# EAGLE design CAS (EAGLE 8.3.1)
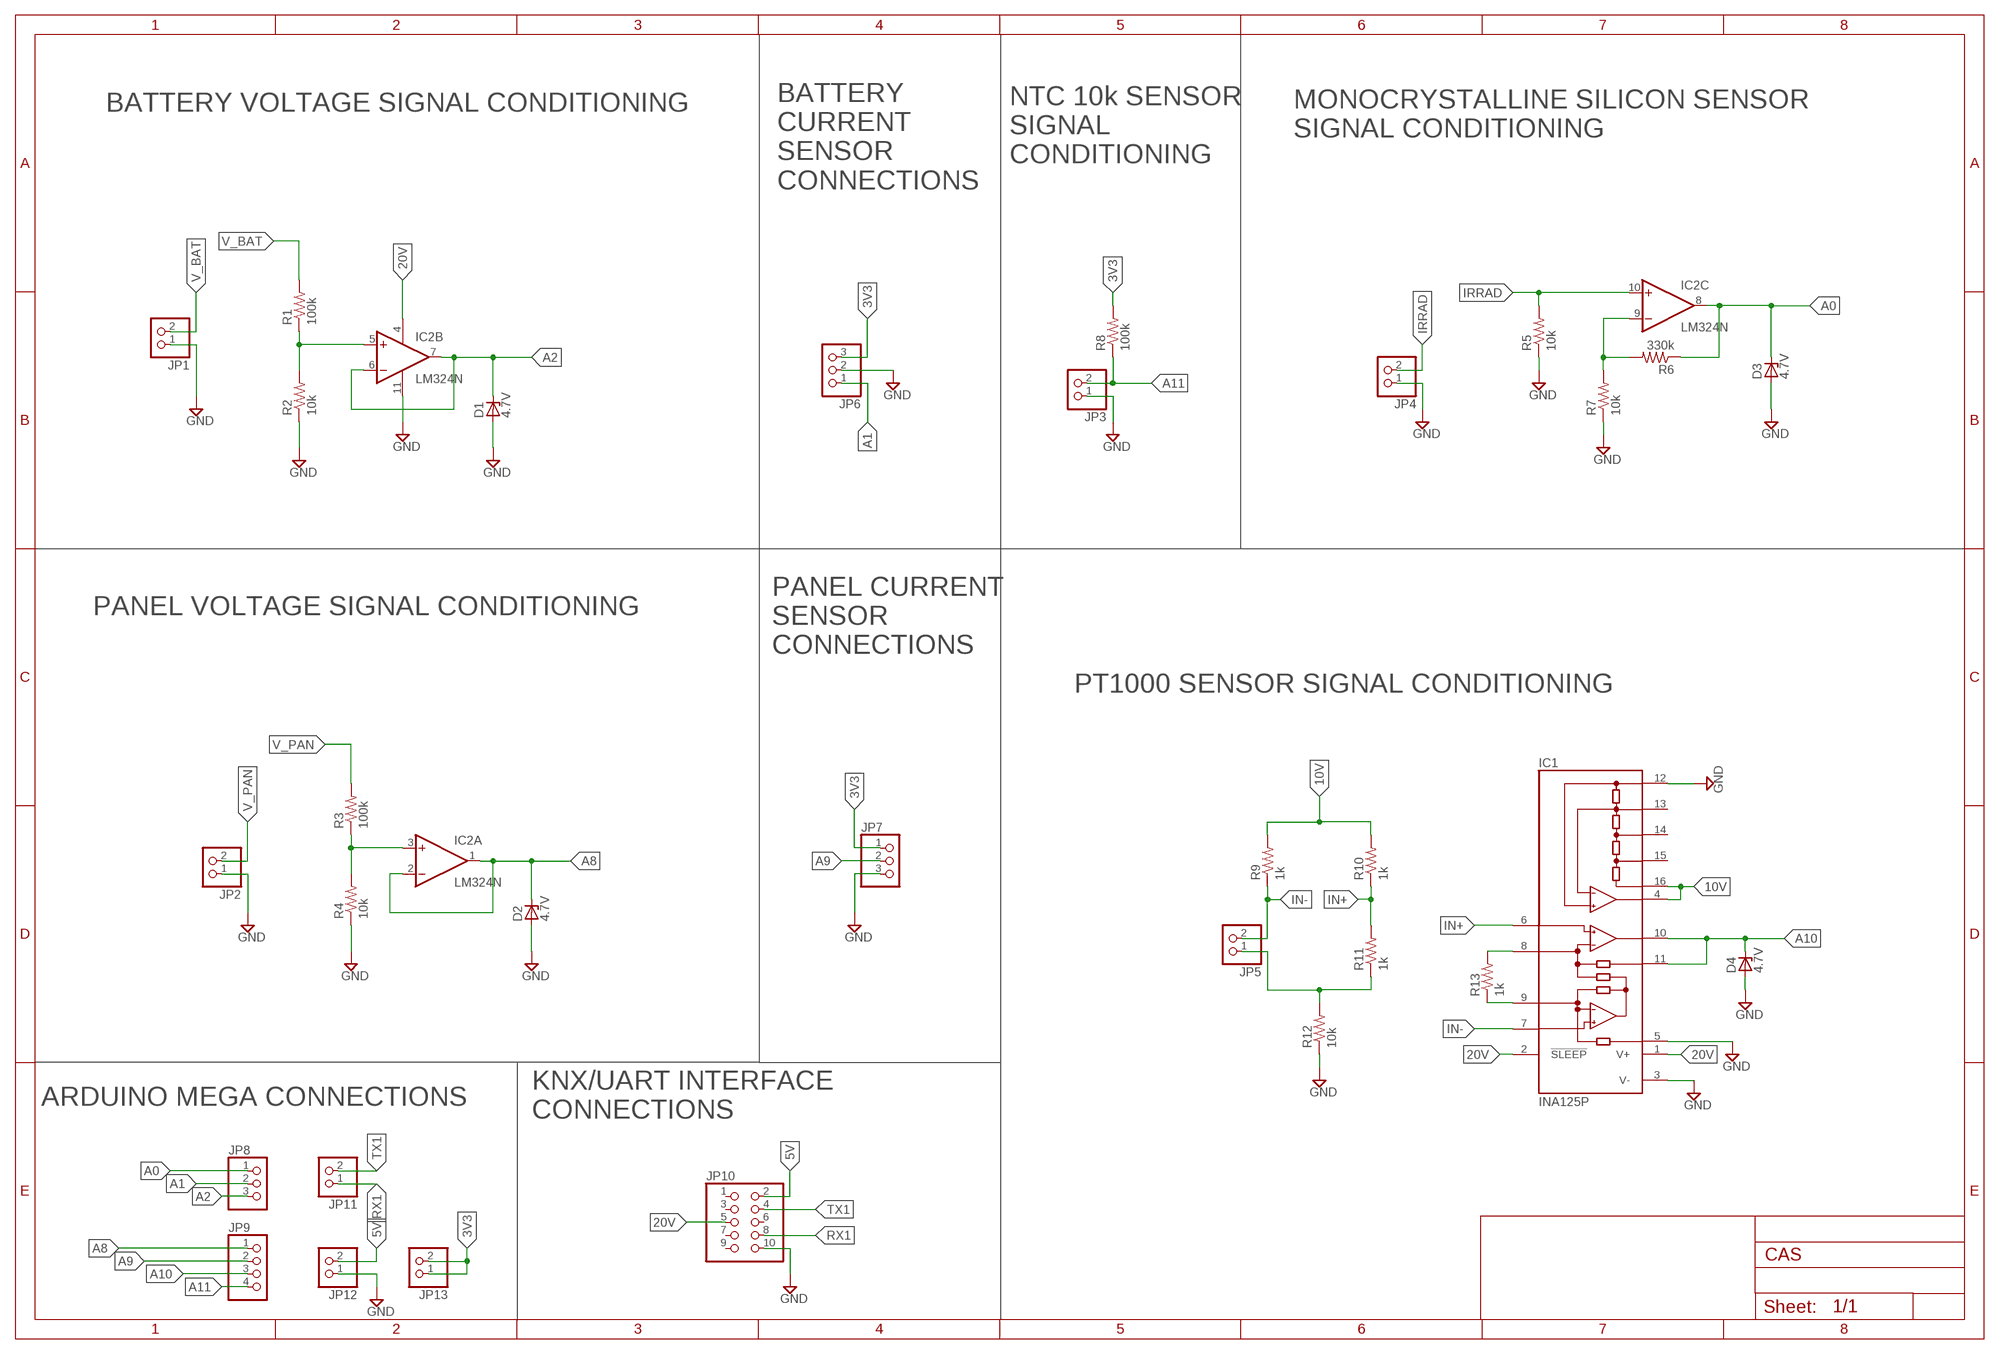
[diagram p0: schematic, sheet 1]

## Parts
D1  4.7V  ZENER-DIODEDO41Z10  [DO41Z10]
D2  4.7V  ZENER-DIODEDO41Z10  [DO41Z10]
D3  4.7V  ZENER-DIODEDO41Z10  [DO41Z10]
D4  4.7V  ZENER-DIODEDO41Z10  [DO41Z10]
IC1  INA125P  [DIL16]
IC2  LM324N  [DIL14]
JP1  PINHD-1X2  [1X02]
JP2  PINHD-1X2  [1X02]
JP3  PINHD-1X2  [1X02]
JP4  PINHD-1X2  [1X02]
JP5  PINHD-1X2  [1X02]
JP6  PINHD-1X3  [1X03]
JP7  PINHD-1X3  [1X03]
JP8  PINHD-1X3  [1X03]
JP9  PINHD-1X4  [1X04]
JP10  PINHD-2X5  [2X05]
JP11  PINHD-1X2  [1X02]
JP12  PINHD-1X2  [1X02]
JP13  PINHD-1X2  [1X02]
R1  100k  R-US_0207/10  [0207/10]
R2  10k  R-US_0207/10  [0207/10]
R3  100k  R-US_0207/10  [0207/10]
R4  10k  R-US_0207/10  [0207/10]
R5  10k  R-US_0207/10  [0207/10]
R6  330k  R-US_0207/10  [0207/10]
R7  10k  R-US_0207/10  [0207/10]
R8  100k  R-US_0207/10  [0207/10]
R9  1k  R-US_0207/10  [0207/10]
R10  1k  R-US_0207/10  [0207/10]
R11  1k  R-US_0207/10  [0207/10]
R12  10k  R-US_0207/10  [0207/10]
R13  1k  R-US_0207/10  [0207/10]

## Nets
3V3: JP6.3 JP7.1 JP13.1 JP13.2 R8.2
5V: JP10.2 JP12.2
10V: IC1.4(REFOUT) IC1.16(REF10) R9.2 R10.2
20V: IC1.1(V+) IC1.2(!SLEEP) IC2.4(P:V+) JP10.5
A0: D3.C IC2.8(C:OUT) JP8.1 R6.1
A1: JP6.1 JP8.2
A2: D1.C IC2.6(B:-IN) IC2.7(B:OUT) JP8.3
A8: D2.C IC2.1(A:OUT) IC2.2(A:-IN) JP9.1
A9: JP7.2 JP9.2
A10: D4.C IC1.10(OUT) IC1.11(SENSE) JP9.3
A11: JP3.2 JP9.4 R8.1
GND: D1.A D2.A D3.A D4.A IC1.3(V-) IC1.5(REF) IC1.12(REFCOM) IC2.11(P:V-) JP1.1 JP2.1 JP3.1 JP4.1 JP6.2 JP7.3 JP10.10 JP12.1 R2.1 R4.1 R5.1 R7.1 R12.1
IN+: IC1.6(+IN) R10.1 R11.2
IN-: IC1.7(-IN) JP5.2 R9.1
IRRAD: IC2.10(C:+IN) JP4.2 R5.2
N$1: IC2.3(A:+IN) R3.1 R4.2
N$2: IC2.5(B:+IN) R1.1 R2.2
N$4: IC2.9(C:-IN) R6.2 R7.2
N$5: IC1.8(RG) R13.2
N$6: IC1.9(RG) R13.1
N$10: JP5.1 R11.1 R12.2
RX1: JP10.8 JP11.1
TX1: JP10.4 JP11.2
V_BAT: JP1.2 R1.2
V_PAN: JP2.2 R3.2
Unconnected: IC1.13(REFBG) IC1.14(REF2.5) IC1.15(REF5) IC2.12(D:+IN) IC2.13(D:-IN) IC2.14(D:OUT) JP10.1 JP10.3 JP10.6 JP10.7 JP10.9

## Notes on the sheet
- BATTERY VOLTAGE SIGNAL CONDITIONING
- MONOCRYSTALLINE SILICON SENSOR 
  SIGNAL CONDITIONING
- NTC 10k SENSOR
  SIGNAL 
  CONDITIONING
- BATTERY
  CURRENT
  SENSOR 
  CONNECTIONS
- PANEL VOLTAGE SIGNAL CONDITIONING
- PANEL CURRENT
  SENSOR 
  CONNECTIONS
- PT1000 SENSOR SIGNAL CONDITIONING
- ARDUINO MEGA CONNECTIONS
- KNX/UART INTERFACE 
  CONNECTIONS

## Library data of the parts
D1-D4 = diode:ZENER-DIODE: Z-Diode
IC1 = burr-brown:INA125: Instrumentation Amplifier with Precision Voltage Reference; MF: TEXAS INSTRUMENT CONNECTORS; MPN: INA125P; OC_FARNELL: 1459461; OC_NEWARK: 35C1726
IC2 = linear:LM324: OP AMP
JP1-JP5 JP11-JP13 = pinhead:PINHD-1X2: PIN HEADER
JP6-JP8 = pinhead:PINHD-1X3: PIN HEADER
JP9 = pinhead:PINHD-1X4: PIN HEADER
JP10 = pinhead:PINHD-2X5: PIN HEADER
R1-R13 = resistor:R-US_: RESISTOR, American symbol

## Board
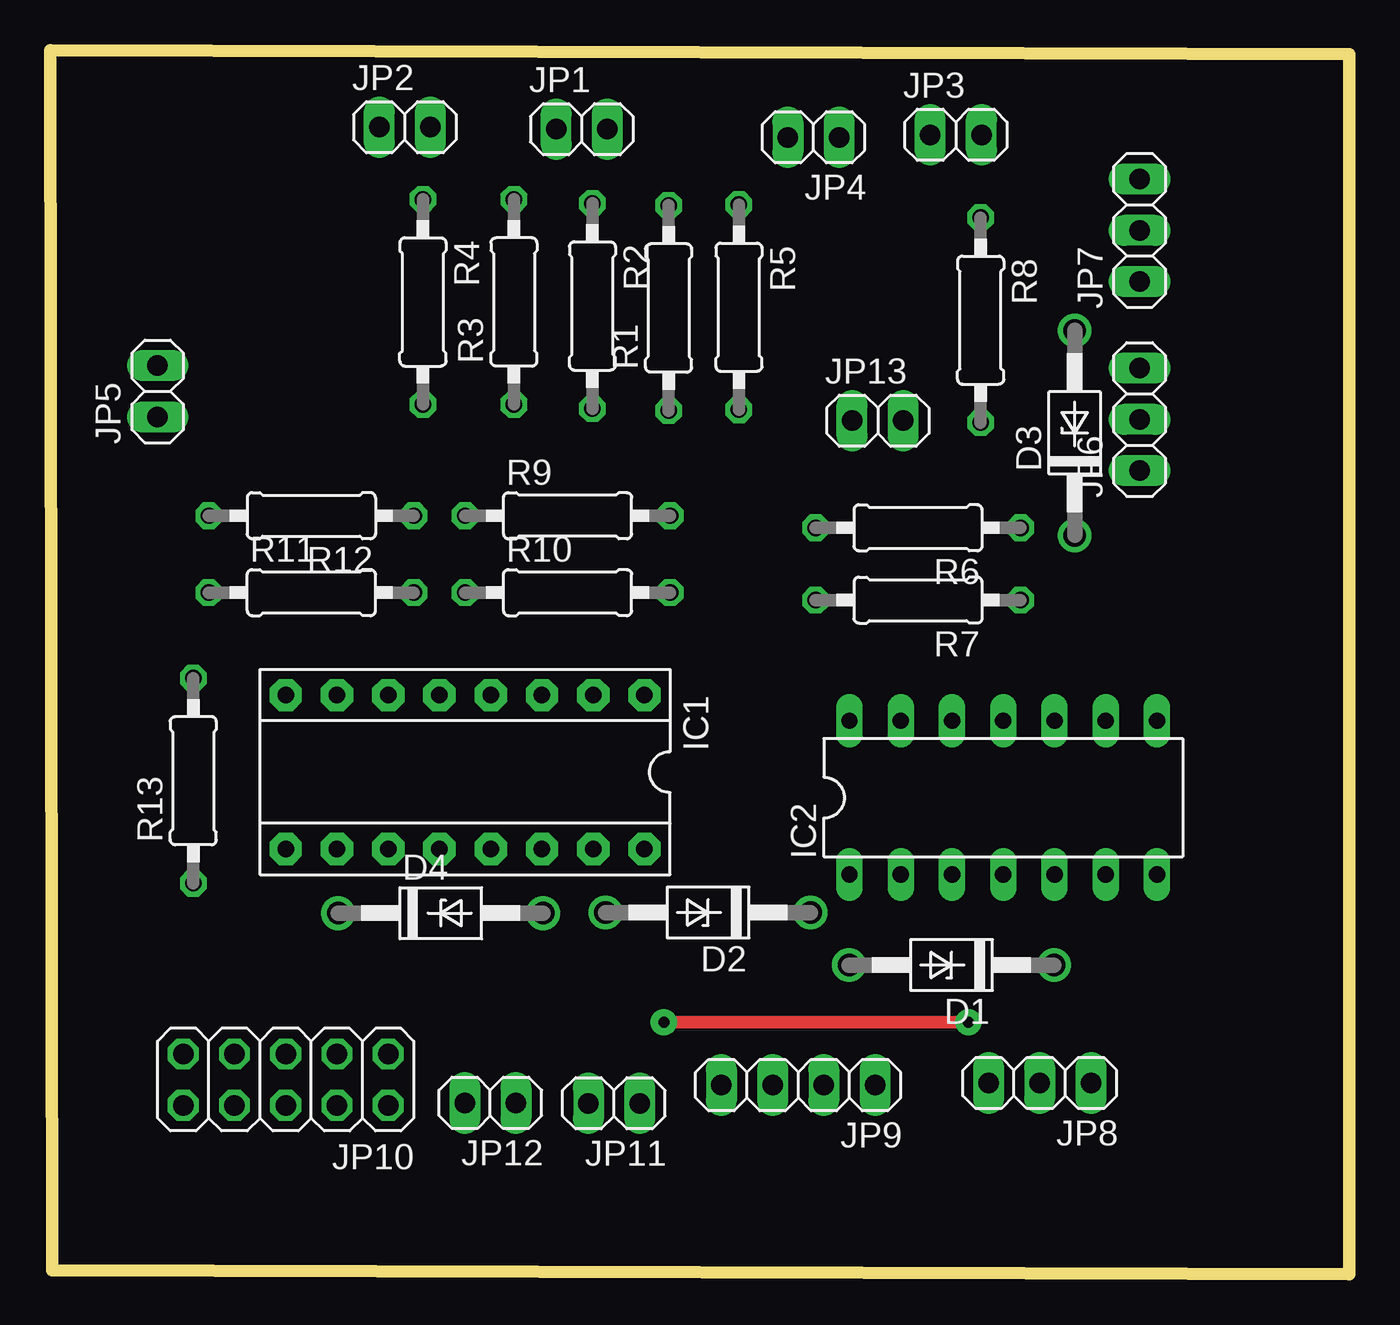
[diagram p1: board, top side]
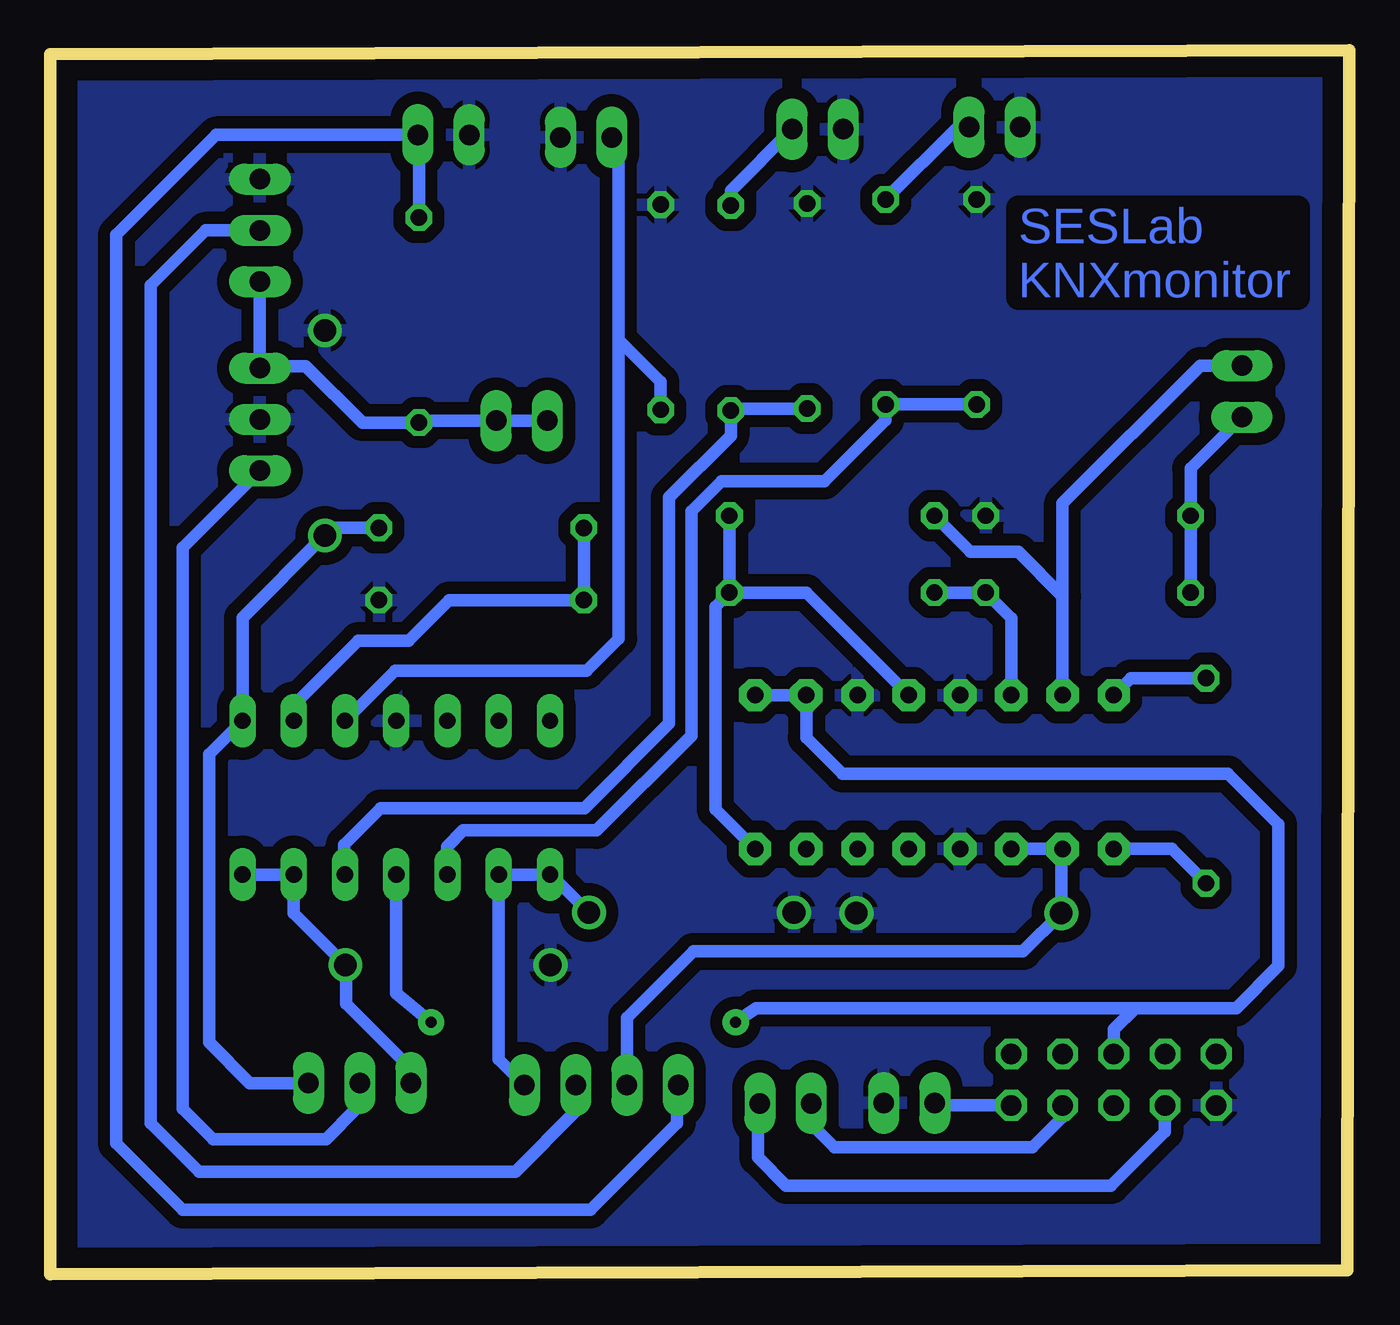
[diagram p2: board, bottom side, seen from below]

Size 64.36 x 60.64 mm. Coordinates in mm from the lower left corner, seen from the top.
Outline: 0.1,0.2 64.36,0 64.36,60.44 0,60.64 0.1,0.2
Copper layers (1*16): Top 0.035mm / dielectric 1.5mm / Bottom 0.035mm
Design rules "default": minimum track width 6mil, minimum drill 0.35mm, track to track 6mil, track to pad 6mil, pad to pad 6mil, via to via 6mil, smd to smd 6mil, copper to edge 40mil, drill to drill 6mil, minimum pad ring 10mil, minimum via ring 8mil, stop-mask expansion 4mil, vias tented up to drill 0mil, thermal gap 10mil

### Footprints (pad centres in the part's own frame; a part is rotated, then mirrored left to right if it is on the bottom)
DO41Z10 = drill 1.118: A 5.08,0; C -5.08,0
DIL16 = drill 0.813 pad 1.6 octagon: 1 -8.89,-3.81; 2 -6.35,-3.81; 3 -3.81,-3.81; 4 -1.27,-3.81; 5 1.27,-3.81; 6 3.81,-3.81; 7 6.35,-3.81; 8 8.89,-3.81; 9 8.89,3.81; 10 6.35,3.81; 11 3.81,3.81; 12 1.27,3.81; 13 -1.27,3.81; 14 -3.81,3.81; 15 -6.35,3.81; 16 -8.89,3.81
DIL14 = drill 0.813 long: 1 -7.62,-3.81; 2 -5.08,-3.81; 3 -2.54,-3.81; 4 0,-3.81; 5 2.54,-3.81; 6 5.08,-3.81; 7 7.62,-3.81; 8 7.62,3.81; 9 5.08,3.81; 10 2.54,3.81; 11 0,3.81; 12 -2.54,3.81; 13 -5.08,3.81; 14 -7.62,3.81
1X02 = drill 1.016 long: 1 -1.27,0; 2 1.27,0
1X03 = drill 1.016 long: 1 -2.54,0; 2 0,0; 3 2.54,0
1X04 = drill 1.016 long: 1 -3.81,0; 2 -1.27,0; 3 1.27,0; 4 3.81,0
2X05 = drill 1.016 octagon: 1 -5.08,-1.27; 2 -5.08,1.27; 3 -2.54,-1.27; 4 -2.54,1.27; 5 0,-1.27; 6 0,1.27; 7 2.54,-1.27; 8 2.54,1.27; 9 5.08,-1.27; 10 5.08,1.27
0207/10 = drill 0.813 octagon: 1 -5.08,0; 2 5.08,0

### Placement (x,y rotation side)
D1  44.66,15.33 180 top
D2  32.59,17.93 180 top
D3  50.76,41.69 90 top
D4  19.34,17.9 0 top
IC1  20.55,24.89 180 top
IC2  47.22,23.62 0 top
JP1  26.33,56.74 0 top
JP2  17.56,56.84 0 top
JP3  44.87,56.46 0 top
JP4  37.82,56.34 180 top
JP5  5.31,43.75 90 top
JP6  53.98,42.36 90 top
JP7  53.98,51.73 90 top
JP8  49.03,9.48 180 top
JP9  37.06,9.38 180 top
JP10  11.66,9.65 180 top
JP11  27.93,8.48 180 top
JP12  21.8,8.5 180 top
JP13  41,42.3 0 top
R1  30.64,47.88 90 top
R2  26.86,47.98 270 top
R3  22.97,48.18 90 top
R4  18.46,48.18 270 top
R5  34.12,47.92 270 top
R6  43,36.99 180 top
R7  43,33.41 180 top
R8  46.1,47.28 270 top
R9  25.63,37.59 0 top
R10  25.63,33.78 0 top
R11  12.93,33.78 0 top
R12  12.93,37.59 180 top
R13  7.08,24.46 90 top

### Tracks (layer width: path | path; a pad name or v marks a point on that pad's centre or on a via)
3V3
  Bottom 0.61: 42.49,42.3 JP13.2 | 42.49,42.3 46,42.3 R8.2 48.9,42.2 51.7,45 53.88,45 JP6.3 JP7.1 | JP13.1 42.49,42.3
5V
  Bottom 0.61: JP10.2 20.41,8.38 JP12.2
10V
  Bottom 0.61: R9.2 R10.2 | IC1.4 26.9,33.78 R10.2 | IC1.16 31.4,23.04 31.4,33.09 R10.2
20V  (via drill 0.55 pad 1.3)
  Top 0.61: v45.5,12.5 v30.4,12.5
  Bottom 0.61: IC1.1 IC1.2 26.9,26.6 25.1,24.8 6,24.8 3.5,22.3 3.5,15.3 5.6,13.2 10.6,13.2 | JP10.5 11.66,12.14 10.6,13.2 | IC2.4 47.22,13.92 v45.5,12.5 | v30.4,12.5 29.4,13.2 10.6,13.2
A0
  Bottom 0.61: JP8.1 54.48,9.48 56.5,11.5 56.5,25.77 IC2.8 54.84,32.53 D3.C 50.38,36.99 R6.1
A1
  Bottom 0.61: JP6.1 57.8,36 57.8,8.2 56.3,6.7 52.5,6.7 52.1,6.7 50.7,6.7 49.2,8.2 49.2,9.31 JP8.2
A2
  Bottom 0.61: IC2.7 IC2.6 52.3,17.89 D1.C 49.7,15.29 49.7,13.4 46.49,10.19 JP8.3
A8
  Bottom 0.61: JP9.1 42.14,10.65 IC2.2 IC2.1 39.55,19.81 D2.C
A9
  Bottom 0.61: JP7.2 56.67,51.73 59.4,49 59.4,7.5 57,5.1 41.3,5.1 38.3,8.1 38.33,8.13 JP9.2
A10
  Bottom 0.61: IC1.11 IC1.10 14.26,21.02 D4.C 16.16,16 32.5,16 35.79,12.71 JP9.3
A11
  Bottom 0.61: R8.1 46.1,56.42 JP3.2 56.14,56.46 61.1,51.5 61.1,6.5 57.8,3.2 37.6,3.2 33.3,7.5 33.3,9.33 JP9.4
GND
  pour Bottom (isolate 0.61): -0.8,62.5 63.4,62.5 63.4,1 -0.8,1
IN+
  Bottom 0.61: R10.1 R11.2 16.74,32.51 IC1.6
IN-
  Bottom 0.61: IC1.7 14.2,33.6 | 14.2,33.6 14.2,38.2 7.38,45.02 JP5.2 | R9.1 18.76,35.8 16.4,35.8 14.2,33.6
IRRAD
  Bottom 0.61: IC2.10 47.29,29.9 37.8,29.9 36.2,31.5 36.2,46.3 | JP4.2 arc90 36.2,55.99 36.2,46.3 | R5.2 34.12,44.22 36.2,46.3
N$1
  Bottom 0.61: R4.2 R3.1 22.97,42.33 26,39.3 31.1,39.3 32.6,37.8 32.6,26.7 37.3,22 43.9,22 44.7,21.2 44.7,19.83 IC2.3
N$2
  Bottom 0.61: R2.2 30.54,42.9 R1.1 30.64,41.56 33.7,38.5 33.7,27.3 37.9,23.1 48,23.1 49.8,21.3 49.8,19.85 IC2.5
N$4
  Bottom 0.61: R6.2 R7.2 44.59,33.41 46.6,31.4 49.1,31.4 52.3,28.2 IC2.9
N$5
  Bottom 0.61: R13.2 10.82,29.54 IC1.8
N$6
  Bottom 0.61: IC1.9 8.78,21.08 R13.1
N$10
  Bottom 0.61: R11.1 R12.2 7.85,39.94 JP5.1
RX1
  Bottom 0.61: JP10.8 9.12,7.08 11.8,4.4 27.9,4.4 29.3,5.8 29.3,8.38 JP11.1
TX1
  Bottom 0.61: JP10.4 14.2,7.8 15.7,6.3 25.5,6.3 26.7,7.5 26.7,8.44 JP11.2
V_BAT
  Bottom 0.61: R1.2 30.64,53.7 JP1.2
V_PAN
  Bottom 0.61: R3.2 19.39,56.84 JP2.2

### Text on the board
Bottom: SESLab / KNXmonitor